# Altium schematic sheet cryptoIC.SchDoc
size A4; SheetNumber: 3; SheetTotal: 3
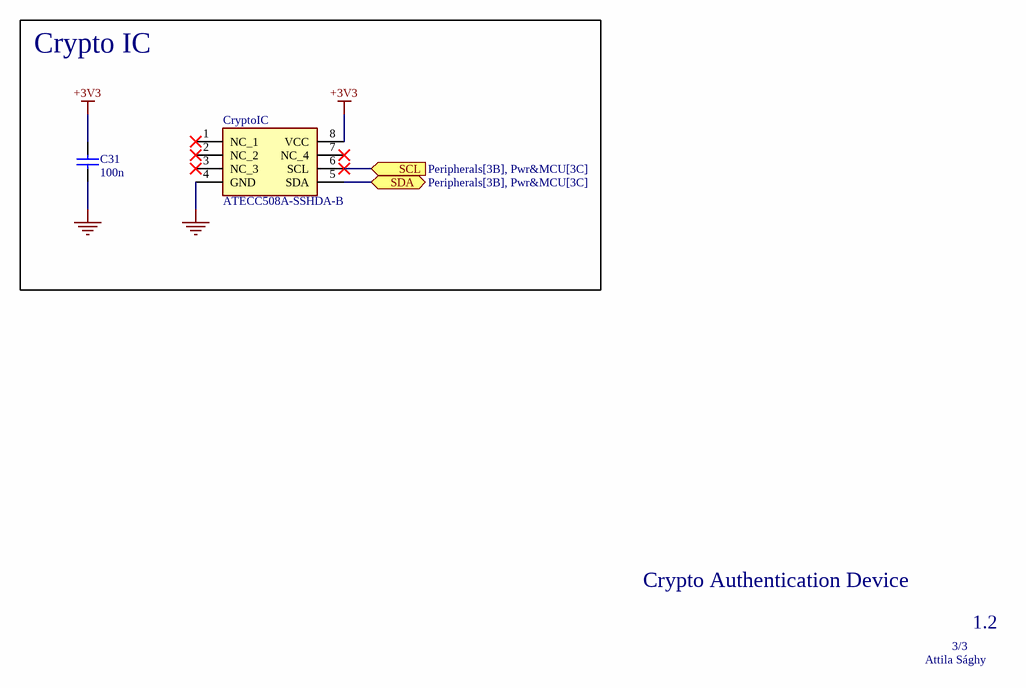
[diagram p0: cryptoIC.SchDoc]

## Parts
C31  100n  [FP_0805_CAP_085]
CryptoIC  ATECC508A-SSHDA-B  [SOIC127P600X175-8N]

## Blocks framed on the sheet
Crypto IC: C31 CryptoIC

## Ports
SCL (in, see Peripherals[3B], Pwr&MCU[3C]), SDA (bidir, see Peripherals[3B], Pwr&MCU[3C])

## Nets
+3V3: C31.2 CryptoIC.8(VCC)
GND: C31.1 CryptoIC.4(GND)
SCL: CryptoIC.6(SCL) ; port SCL
SDA: CryptoIC.5(SDA) ; port SDA

Not connected (* = marked no-connect by the designer): CryptoIC 1(NC_1)* 2(NC_2)* 3(NC_3)* 7(NC_4)*

## Notes on the sheet
- Crypto Authentication Device
- 3/3
- 1.2
- Attila Sághy

## Library data of the parts
C31 = CAP: Capacitor; Value: 100n
CryptoIC = ATECC508A-SSHDA-B: Integrated Circuit; Manufacturer_Name: Microchip; Datasheet Link: http://ww1.microchip.com/downloads/en/DeviceDoc/20005928A.pdf; Height: 1.75mm; Manufacturer_Part_Number: ATECC508A-SSHDA-B; Mouser Part Number: 556-ATECC508A-SSHDAB; Mouser Price/Stock: https://www.mouser.co.uk/ProductDetail/Microchip-Technology/ATECC508A-SSHDA-B?qs=1PHB%252BsnDjhE35x3AnwPadw%3D%3D; Arrow Part Number: ATECC508A-SSHDA-B; Arrow Price/Stock: https://www.arrow.com/en/products/atecc508a-sshda-b/microchip-technology